# Altium project 461_Tut.PrjPcb
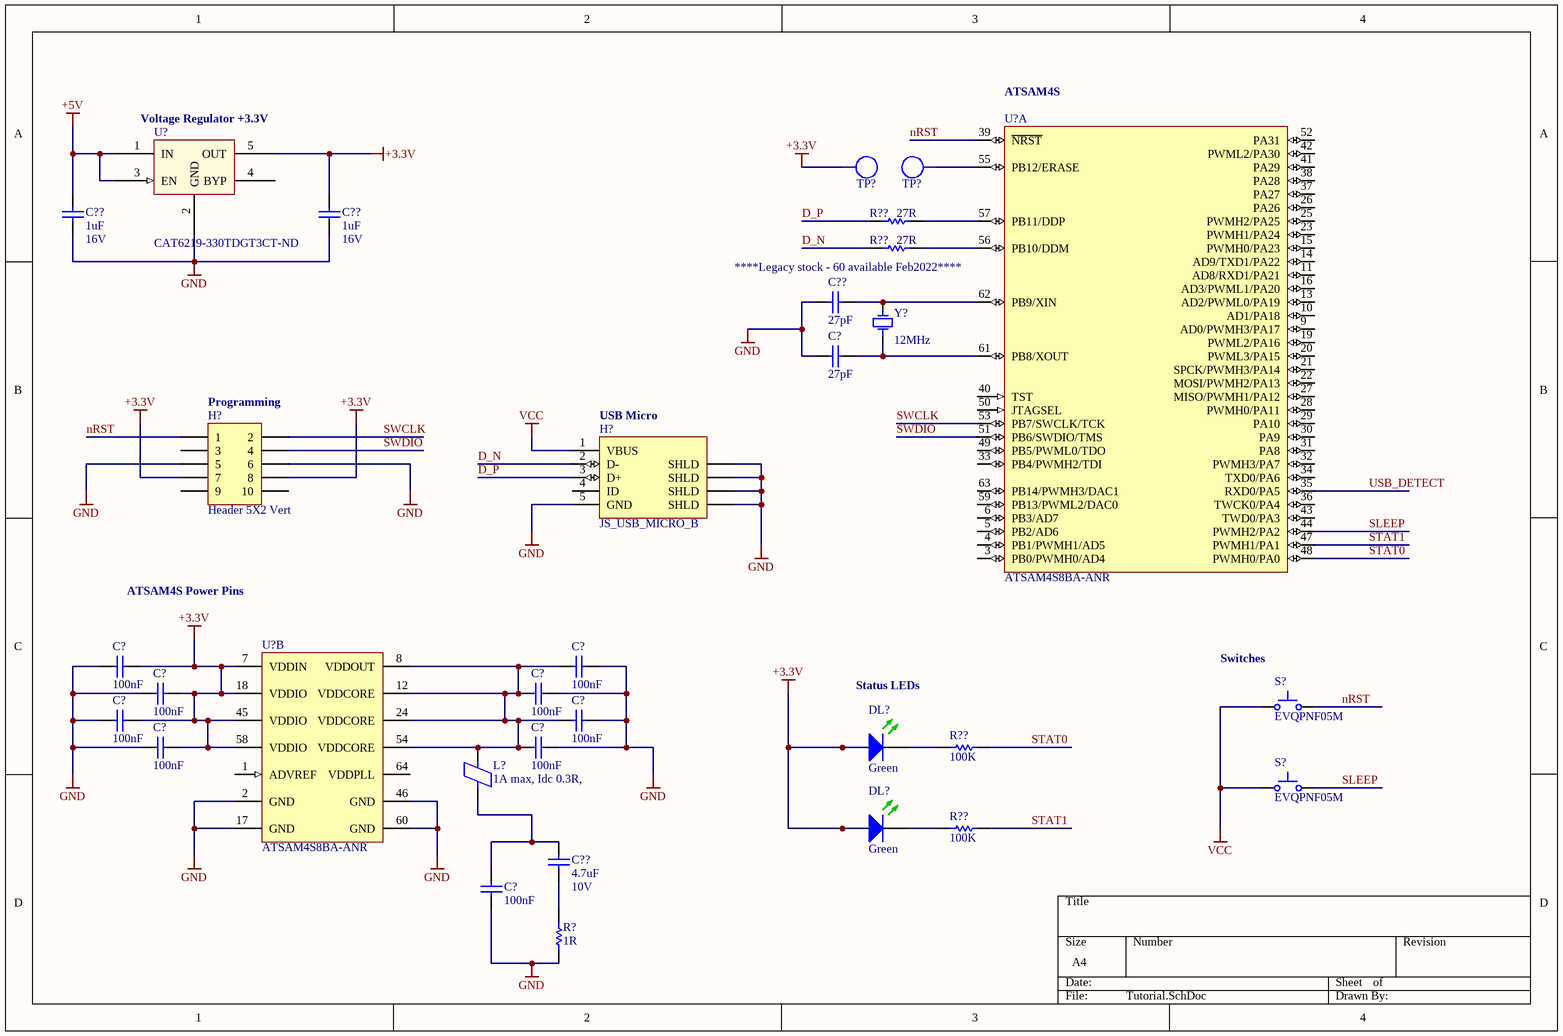
[diagram p0: Tutorial.SchDoc]
1 sheet, 32 parts. Net scope: global (net labels, ports and power ports of the same name join across sheets).

## Sheet Tutorial.SchDoc: SYH18_Tut
size A4; Author: Shou-Yick; DrawnBy: Shou-Yick; SheetNumber: 1; SheetTotal: 1

### Parts
(Parts that share a designator on the sheet are numbered #1, #2 ... from top to bottom, then left to right.)
C?#1  27pF  [CAPC1608L]
C?#2  100nF  [CAPC1608L]
C?#3  100nF  [CAPC1608L]
C?#4  100nF  [CAPC1608L]
C?#5  100nF  [CAPC1608L]
C?#6  100nF  [CAPC1608L]
C?#7  100nF  [CAPC1608L]
C?#8  100nF  [CAPC1608L]
C?#9  100nF  [CAPC1608L]
C?#10  100nF  [CAPC1608L]
C??#1  Max Voltage: 16V  [CAPC1608L]  (hidden comment: 1uF)
C??#2  Max Voltage: 16V  [CAPC1608L]  (hidden comment: 1uF)
C??#3  27pF  [CAPC1608L]
C??#4  Max Voltage: 10V  [CAPC1608N]  (hidden comment: 4.7uF)
DL?#1  Green  [WL-SMCW0603]
DL?#2  Green  [WL-SMCW0603]
H?#1  Header 5X2 Vert  [IDC2.54-V10D]
H?#2  JS_USB_MICRO_B  [FCI_USB_10118194-0001LF]
L?  1A max, Idc 0.3R,  [INDC3216L]
R?  1R  [RESC3216L]
R??#1  27R  [RESC1608L]
R??#2  27R  [RESC1608L]
R??#3  100K  [RESC1608L]
R??#4  100K  [RESC1608L]
S?#1  EVQPNF05M  [EVQPNF05M]
S?#2  EVQPNF05M  [EVQPNF05M]
TP?#1  TP_0603  [TP_0603]  (value not drawn)
TP?#2  TP_0603  [TP_0603]  (value not drawn)
U?#1  ATSAM4S8BA-ANR  [LQFP64_L]  (part A of 2)
U?#2  Supplier Part Number: CAT6219-330TDGT3CT-ND  [SOT95P280X145-5N]  (hidden comment: CAT6219-330TDGT3)
U?#3  ATSAM4S8BA-ANR  [LQFP64_L]  (part B of 2)
Y?  ****Legacy stock - 60 available Feb2022****  value 12MHz  [HC49/4h_SMX]

### Nets
+3.3V: C?#2.1 C?#4.1 C?#6.1 C?#8.1 C??#2.2 DL?#1.2(A) DL?#2.2(A) H?#1.7 H?#1.8 TP?#1.1(TP) U?#2.5(OUT) U?#3.7(VDDIN) U?#3.18(VDDIO) U?#3.45(VDDIO) U?#3.58(VDDIO)
+5V: C??#1.2 U?#2.1(IN) U?#2.3(EN)
GND: C?#1.2 C?#2.2 C?#3.2 C?#4.2 C?#5.2 C?#6.2 C?#7.2 C?#8.2 C?#9.2 C?#10.2 C??#1.1 C??#2.1 C??#3.2 H?#1.5 H?#1.6 H?#2.5(GND) H?#2.6(SHLD) R?.1 U?#2.2(GND) U?#3.2(GND) U?#3.17(GND) U?#3.46(GND) U?#3.60(GND)
VCC: H?#2.1(VBUS) S?#1.1 S?#2.1
D_N: H?#2.2(D-) R??#2.1
D_P: H?#2.3(D+) R??#1.1
nRST: H?#1.1 S?#1.2 U?#1.39(~{NRST})
SLEEP: S?#2.2 U?#1.44(PWMH2/PA2)
STAT0: R??#3.2 U?#1.48(PWMH0/PA0)
STAT1: R??#4.2 U?#1.47(PWMH1/PA1)
SWCLK: H?#1.2 U?#1.53(PB7/SWCLK/TCK)
SWDIO: H?#1.4 U?#1.51(PB6/SWDIO/TMS)
USB_DETECT: U?#1.35(RXD0/PA5)
NetC?#1_1: C?#1.1 U?#1.61(PB8/XOUT) Y?.1(OSC1)
NetC?#3_1: C?#3.1 C?#5.1 C?#7.1 C?#9.1 L?.2 U?#3.8(VDDOUT) U?#3.12(VDDCORE) U?#3.24(VDDCORE) U?#3.54(VDDCORE)
NetC?#10_1: C?#10.1 C??#4.2 L?.1
NetC??#3_1: C??#3.1 U?#1.62(PB9/XIN) Y?.2(OSC2)
NetC??#4_1: C??#4.1 R?.2
NetDL?#1_1: DL?#1.1(K) R??#3.1
NetDL?#2_1: DL?#2.1(K) R??#4.1
NetR??#1_2: R??#1.2 U?#1.57(PB11/DDP)
NetR??#2_2: R??#2.2 U?#1.56(PB10/DDM)
NetTP?#2_1: TP?#2.1(TP) U?#1.55(PB12/ERASE)

Not connected (* = marked no-connect by the designer): H?#1 3 9 10; H?#2 4(ID); U?#1 3(PB0/PWMH0/AD4) 4(PB1/PWMH1/AD5) 5(PB2/AD6) 6(PB3/AD7) 9(AD0/PWMH3/PA17) 10(AD1/PA18) 11(AD8/RXD1/PA21) 13(AD2/PWML0/PA19) 14(AD9/TXD1/PA22) 15(PWMH0/PA23) 16(AD3/PWML1/PA20) 19(PWML2/PA16) 20(PWML3/PA15) 21(SPCK/PWMH3/PA14) 22(MOSI/PWMH2/PA13) 23(PWMH1/PA24) 25(PWMH2/PA25) 26(PA26) 27(MISO/PWMH1/PA12) 28(PWMH0/PA11) 29(PA10) 30(PA9) 31(PA8) 32(PWMH3/PA7) 33(PB4/PWMH2/TDI) 34(TXD0/PA6) 36(TWCK0/PA4) 37(PA27) 38(PA28) 40(TST) 41(PA29) 42(PWML2/PA30) 43(TWD0/PA3) 49(PB5/PWML0/TDO) 50(JTAGSEL) 52(PA31) 59(PB13/PWML2/DAC0) 63(PB14/PWMH3/DAC1); U?#2 4(BYP); U?#3 1(ADVREF) 64(VDDPLL)

### Notes on the sheet
- (near U?#1) ATSAM4S
- (near U?#2) Voltage Regulator +3.3V
- (near H?#1) Programming
- (near H?#2) USB Micro
- ATSAM4S Power Pins
- Status LEDs
- (near S?#1) Switches

### Library data of the parts
C?#1 C??#3 = CC_27pF_0603: CAP CER 27pF NPO/COG +-5% 50V 0603; PackageReference: 0603; Code_IPC: 1608 [0603]; Verify: *; Supplier: ECE Dept; Storage Location: PCB Assembly WS; Value: 27pF
C?#2-C?#10 = CC_100nF_0603: CAP CER 100nF X7R +-10% 50V 0603; PackageReference: 0603; Code_IPC: 1608 [0603]; Verify: *; Supplier: ECE Dept; Storage Location: PCB Assembly WS; Value: 100nF
C??#1 C??#2 = CC_1uF_0603: CAP CER 1uF Y5V -20% +80% 16V 0603; PackageReference: 0603; Code_IPC: 1608 [0603]; Verify: *; Supplier: ECE Dept; Storage Location: PCB Assembly WS; Value: 1uF
C??#4 = CC_4.7uF_0603: CAP CER 4.7uF X5R +-20%  10V 0603; Note: Footprint corresponds to dimensions for bulk cassette packaging. This case size has tightened tolerances.; PackageReference: 0805; Code_IPC: 2012[0805]; Verify: *; Supplier: ECE Dept; Storage Location: PCB Assembly WS; Value: 4.7uF
DL?#1 DL?#2 = DL_150060GS75000: LED Green 430mcd 0603 SMD; Manufacturer: WURTH ELEKTRONIK; Forward Current If: 30; Wavelength Typ: 520; Forward Voltage: 3.2; Lens Shape: Rectangular; Luminous Intensity: 430; Viewing Angle: 140°; LED Mounting: SMD; Supplier 1: Farnell; Supplier Part Number 1: 2322070; Manufacturer Part Number: 150060GS75000; Storage Location: PCB Assembly WS; Supplier: ECE Dept; LED Colour: Green
H?#1 = JA_HDR_IDC_5X2_VERT: IDC Header, 2,54mm, 10-Pin, Vert; Supplier: ECE Dept; Supplier 1: Farnell; Supplier Part Number 1: 1096985; Storage Location: ECE Dept Store
H?#2 = JS_USB_MICRO_B_SMT: CONN USB MICRO B RECPT SMT R/A; Manufacturer: FCI; Manufacturer Part Number: 10118194-0001LF; Gender: Receptacle; Number of Contacts: 5; Specifications: USB 2.0; Supplier 1: Digi-Key; Supplier Part Number 1: 609-4618-1-ND; Features: Shielded, Solder Retention; Mounting Type: Surface Mount, Right Angle, Horizontal
L? = IN_Ferrite-Bead: Ferrite Bead, Rdc 0.3R, Z100MHZ 600R, Imax 1A, SMD 1206; Manufacturer: FAIR-RITE; Manufacturer PN: 2512066017Y1; DC Current Rating: 1; DC Resistance Max: 0.08; Ferrite Case Style: 1206 ^3216 Metric]; Frequency Range: 50MHz to 1; Impedance: 600; Impedance Tolerance: ± 25%; Supplier: ECE Dept; Storage Location: PCB Assembly WS; Ferrite Mounting: SMD; Supplier 1: Farnell; Supplier Part Number 1: 1612060; Manufacturer Part Number: 2512066017Y1; Value: 1A max, Idc 0.3R,
R? = RT_1R: RES 1R OHM 1/4W 5% 1206 SMD; Storage Location: PCB Assembly WS; Supplier: ECE Dept; Value: 1R
R??#1 R??#2 = RS_27R: RES 27 OHM 1/10W 5% 0603 SMD; Storage Location: PCB Assembly WS; Supplier: ECE Dept; Value: 27R
R??#3 R??#4 = RS_100K: RES 100K OHM 1/10W 5% 0603 SMD; Storage Location: PCB Assembly WS; Supplier: ECE Dept; Value: 100K
S?#1 S?#2 = WS_EVQPNF05M: Panasonic 6 x 3.5mm SMD Light Touch Switch Type SMD; PackageDescription: 6.0 x 3.5 mm; Supplier 1: Farnell; Supplier Part Number 1: 2079481; Manufacturer: Panasonic; Manufacturer PN: EVQPNF05M; Supplier 2: Digi-Key; Supplier Part Number 2: P13598SCT-ND; Storage Location: PCB Assembly WS; Supplier: ECE Dept
TP?#1 TP?#2 = TP_0603: Test Point 1.65X0.9X1.2mm SMD; Manufacturer: TE Connectivity AMP Connectors; Manufacturer Part Number: 1625854-3; Supplier 1: Digi-Key; Mounting Type: Surface Mount; Terminal: 0.063" x 0.031" x 0.045" (1.60mm x 0.80mm x 1.15mm); Type: PC Test Point; Supplier Part Number 1: A106145CT-ND
U?#1 U?#3 = SE_ATSAM4S16BA-MU: IC MCU 32BIT 512KB FLASH 64LQFP; Manufacturer: Atmel; Connectivity: I²C, IrDA, Memory Card, SPI, SSC, UART/USART, USB; Core Processor: ARM® Cortex®-M4; Core Size: 32-Bit; Data Converters: A/D 11x12b, D/A 2x12b; Number of I/O: 47; Peripherals: Brown-out Detect/Reset, DMA, POR, PWM, WDT; Program Memory Size: 512KB (512K x 8); RAM Size: 128K x 8; Speed: 120MHz; Voltage - Supply (Vcc/Vdd): 1.62 V ~ 3.6 V; PackageVersion: revJ, Jul-2007; PackageReference: 64PS; PackageDescription: 64-Pin Quad Flat No-Lead (QFN) Sawn, 9 x 9 x 1.0 mm Body, 0.5 mm Pitch, Exposed Pad; Code_JEDEC: MO-220VMMD-3; ComponentLink1Description: Manufacturer URL; ComponentLink1URL: http://www.atmel.com/; ComponentLink2Description: SAM4S Series Datasheet; ComponentLink2URL: http://www.atmel.com/dyn/resources/prod_documents/11100.pdf; ComponentLink3Description: SAM4S Series Summary; ComponentLink3URL: http://www.atmel.com/dyn/resources/prod_documents/11100S.pdf; Supplier 1: Digi-Key; Package / Case: 64-LQFP; Packaging: Cut Tape (CT); Program Memory Type: FLASH; Supplier Part Number 1: ATSAM4S8BA-ANRCT-ND; Manufacturer Part Number: ATSAM4S8BA-ANR
U?#2 = SV_CAT6219-330TDGT3: IC REG LIN 3.3V 500MA TSOT23-5; Voltage - Input (Max): 5.5V; Voltage Dropout (Max): 0.5V @ 500mA; Manufacturer Part Number: CAT6219-330TDGT3; Base Part Number: CAT6219; Current - Output: 500mA; Package / Case: SOT-23-5 Thin, TSOT-23-5; Supplier: Digi-Key; Supplier Device Package: TSOT-23-5; Voltage - Output (Min/Fixed): 3.3V; ComponentLink1URL: http://www.onsemi.com/pub/Collateral/CAT6219-D.PDF; ComponentLink1Description: http://www.onsemi.com/pub/Collateral/CAT6219-D.PDF; Supplier 1: Digi-Key; ComponentLink2Description: CAT6219 Datasheet; ComponentLink2URL: \\maxwell\elecapp\AltiumDesigner\Libraries\DatasheetsNew\ENCE461\CAT6219-D.PDF
Y? = XT_CRYSTAL_12MHz: 12.00 MHZ 18PF HC49/4H SMD; Manufacturer: Abracon Corporation; Manufacturer PN: ABLS-8.000MHZ-B2-T; Supplier 1: Farnell; Supplier Part Number 1: 1842280; Storage Location: PCB Assembly WS; Supplier: ECE Dept; Supplier 2: Digi-Key; Supplier Part Number 2: 535-10218-1-ND